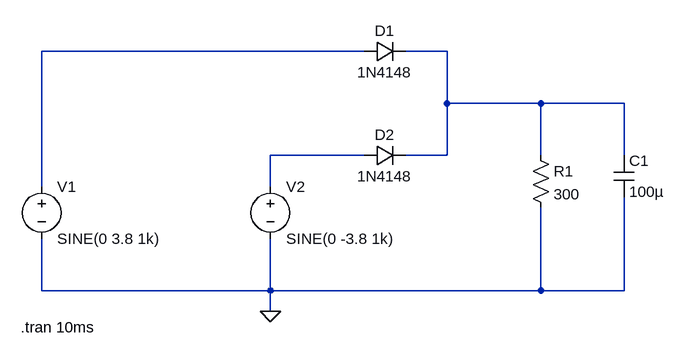
[diagram p0: schematic project1_official.asc]
project1_official.asc, the LTspice schematic file:
Version 4.1
SHEET 1 880 680
WIRE -16 32 -512 32
WIRE 112 32 48 32
WIRE 112 112 112 32
WIRE 256 112 112 112
WIRE 384 112 256 112
WIRE -16 192 -160 192
WIRE 112 192 112 112
WIRE 112 192 48 192
WIRE 256 192 256 112
WIRE 384 192 384 112
WIRE -512 240 -512 32
WIRE -160 240 -160 192
WIRE -512 400 -512 320
WIRE -160 400 -160 320
WIRE -160 400 -512 400
WIRE 256 400 256 272
WIRE 256 400 -160 400
WIRE 384 400 384 256
WIRE 384 400 256 400
WIRE -160 432 -160 400
FLAG -160 432 0
SYMBOL voltage -512 224 R0
WINDOW 123 0 0 Left 0
WINDOW 39 0 0 Left 0
SYMATTR InstName V1
SYMATTR Value SINE(0 3.8 1k)
SYMBOL voltage -160 224 R0
WINDOW 123 0 0 Left 0
WINDOW 39 0 0 Left 0
SYMATTR InstName V2
SYMATTR Value SINE(0 -3.8 1k)
SYMBOL diode -16 48 R270
WINDOW 0 32 32 VTop 2
WINDOW 3 0 32 VBottom 2
SYMATTR InstName D1
SYMATTR Value 1N4148
SYMBOL diode -16 208 R270
WINDOW 0 32 32 VTop 2
WINDOW 3 0 32 VBottom 2
SYMATTR InstName D2
SYMATTR Value 1N4148
SYMBOL res 240 176 R0
SYMATTR InstName R1
SYMATTR Value 300
SYMBOL cap 368 192 R0
SYMATTR InstName C1
SYMATTR Value 100µ
TEXT -544 456 Left 2 !.tran 10ms

The netlist it stands for:
* project1_official.asc
V1 N001 0 SINE(0 3.8 1k)
V2 N003 0 SINE(0 -3.8 1k)
D1 N001 N002 1N4148
D2 N003 N002 1N4148
R1 N002 0 300
C1 N002 0 100µ
.model D D
.lib standard.dio
.tran 10ms
.backanno
.end